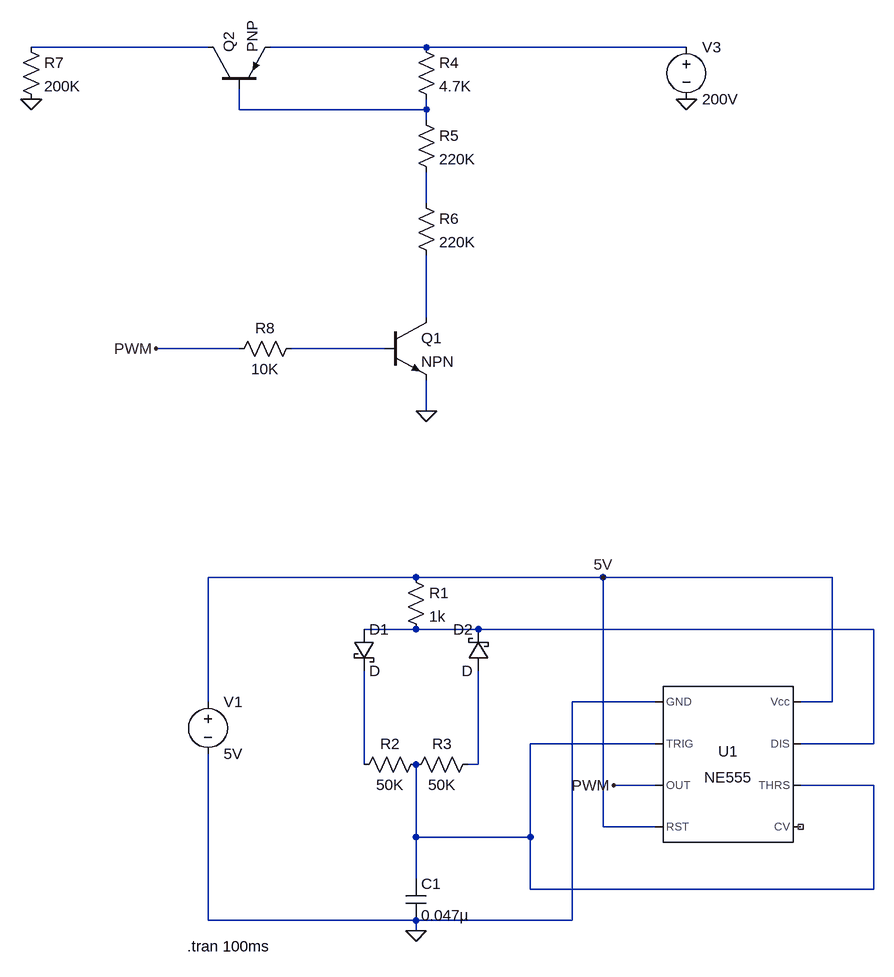
[diagram p0: schematic combined.asc]
combined.asc, the LTspice schematic file:
Version 4
SHEET 1 880 680
WIRE -592 -928 -864 -928
WIRE -256 -928 -496 -928
WIRE 144 -928 -256 -928
WIRE -544 -832 -544 -864
WIRE -256 -832 -256 -848
WIRE -256 -832 -544 -832
WIRE -256 -816 -256 -832
WIRE -256 -688 -256 -736
WIRE -256 -512 -256 -608
WIRE -544 -464 -672 -464
WIRE -320 -464 -464 -464
WIRE -256 -368 -256 -416
WIRE -272 -112 -592 -112
WIRE 16 -112 -272 -112
WIRE 368 -112 16 -112
WIRE -272 -32 -352 -32
WIRE -176 -32 -272 -32
WIRE 432 -32 -176 -32
WIRE -592 80 -592 -112
WIRE 96 80 -32 80
WIRE 368 80 368 -112
WIRE 368 80 320 80
WIRE 96 144 -96 144
WIRE 432 144 432 -32
WIRE 432 144 320 144
WIRE -352 176 -352 32
WIRE -176 176 -176 32
WIRE -176 176 -192 176
WIRE 96 208 32 208
WIRE 432 208 320 208
WIRE 16 272 16 -112
WIRE 96 272 16 272
WIRE -272 288 -272 176
WIRE -96 288 -96 144
WIRE -96 288 -272 288
WIRE -272 352 -272 288
WIRE -96 368 -96 288
WIRE 432 368 432 208
WIRE 432 368 -96 368
WIRE -592 416 -592 160
WIRE -272 416 -592 416
WIRE -32 416 -32 80
WIRE -32 416 -272 416
WIRE -272 432 -272 416
FLAG -272 432 0
FLAG 16 -112 5V
FLAG 144 -848 0
FLAG -256 -368 0
FLAG -864 -848 0
FLAG -672 -464 PWM
FLAG 32 208 PWM
SYMBOL Misc\\NE555 208 176 R0
SYMATTR InstName U1
SYMBOL res -288 -128 R0
SYMATTR InstName R1
SYMATTR Value 1k
SYMBOL res -256 160 R90
WINDOW 0 0 56 VBottom 2
WINDOW 3 32 56 VTop 2
SYMATTR InstName R2
SYMATTR Value 50K
SYMBOL res -288 192 R270
WINDOW 0 32 56 VTop 2
WINDOW 3 0 56 VBottom 2
SYMATTR InstName R3
SYMATTR Value 50K
SYMBOL schottky -368 -32 R0
SYMATTR InstName D1
SYMBOL schottky -160 32 R180
WINDOW 0 24 64 Left 2
WINDOW 3 24 0 Left 2
SYMATTR InstName D2
SYMBOL cap -288 352 R0
SYMATTR InstName C1
SYMATTR Value 0.047µ
SYMBOL voltage -592 64 R0
WINDOW 123 0 0 Left 2
WINDOW 39 0 0 Left 2
SYMATTR InstName V1
SYMATTR Value 5V
SYMBOL res -272 -944 R0
SYMATTR InstName R4
SYMATTR Value 4.7K
SYMBOL res -272 -832 R0
SYMATTR InstName R5
SYMATTR Value 220K
SYMBOL res -272 -704 R0
SYMATTR InstName R6
SYMATTR Value 220K
SYMBOL res -880 -944 R0
SYMATTR InstName R7
SYMATTR Value 200K
SYMBOL res -448 -480 R90
WINDOW 0 0 56 VBottom 2
WINDOW 3 32 56 VTop 2
SYMATTR InstName R8
SYMATTR Value 10K
SYMBOL npn -320 -512 R0
SYMATTR InstName Q1
SYMBOL pnp -592 -864 R270
SYMATTR InstName Q2
SYMBOL voltage 144 -944 R0
WINDOW 123 0 0 Left 2
WINDOW 39 0 0 Left 2
SYMATTR InstName V3
SYMATTR Value 200V
TEXT -624 456 Left 2 !.tran 100ms

The netlist it stands for:
* combined.asc
XU1 0 N008 PWM 5V NC_01 N008 N007 5V NE555  ; pins GND TRIG OUT RST CV THRS DIS Vcc
R1 5V N007 1k
R2 N008 N009 50K
R3 N008 N010 50K
D1 N007 N009 D
D2 N010 N007 D
C1 N008 0 0.047µ
V1 5V 0 5V
R4 N002 N003 4.7K
R5 N003 N004 220K
R6 N004 N005 220K
R7 N001 0 200K
R8 N006 PWM 10K
Q1 N005 N006 0 0 NPN
Q2 N001 N003 N002 0 PNP
V3 N002 0 200V
.model D D
.lib standard.dio
.model NPN NPN
.model PNP PNP
.lib standard.bjt
.tran 100ms
.lib NE555.sub
.backanno
.end